# EAGLE design cyboard (EAGLE 9.6.2)
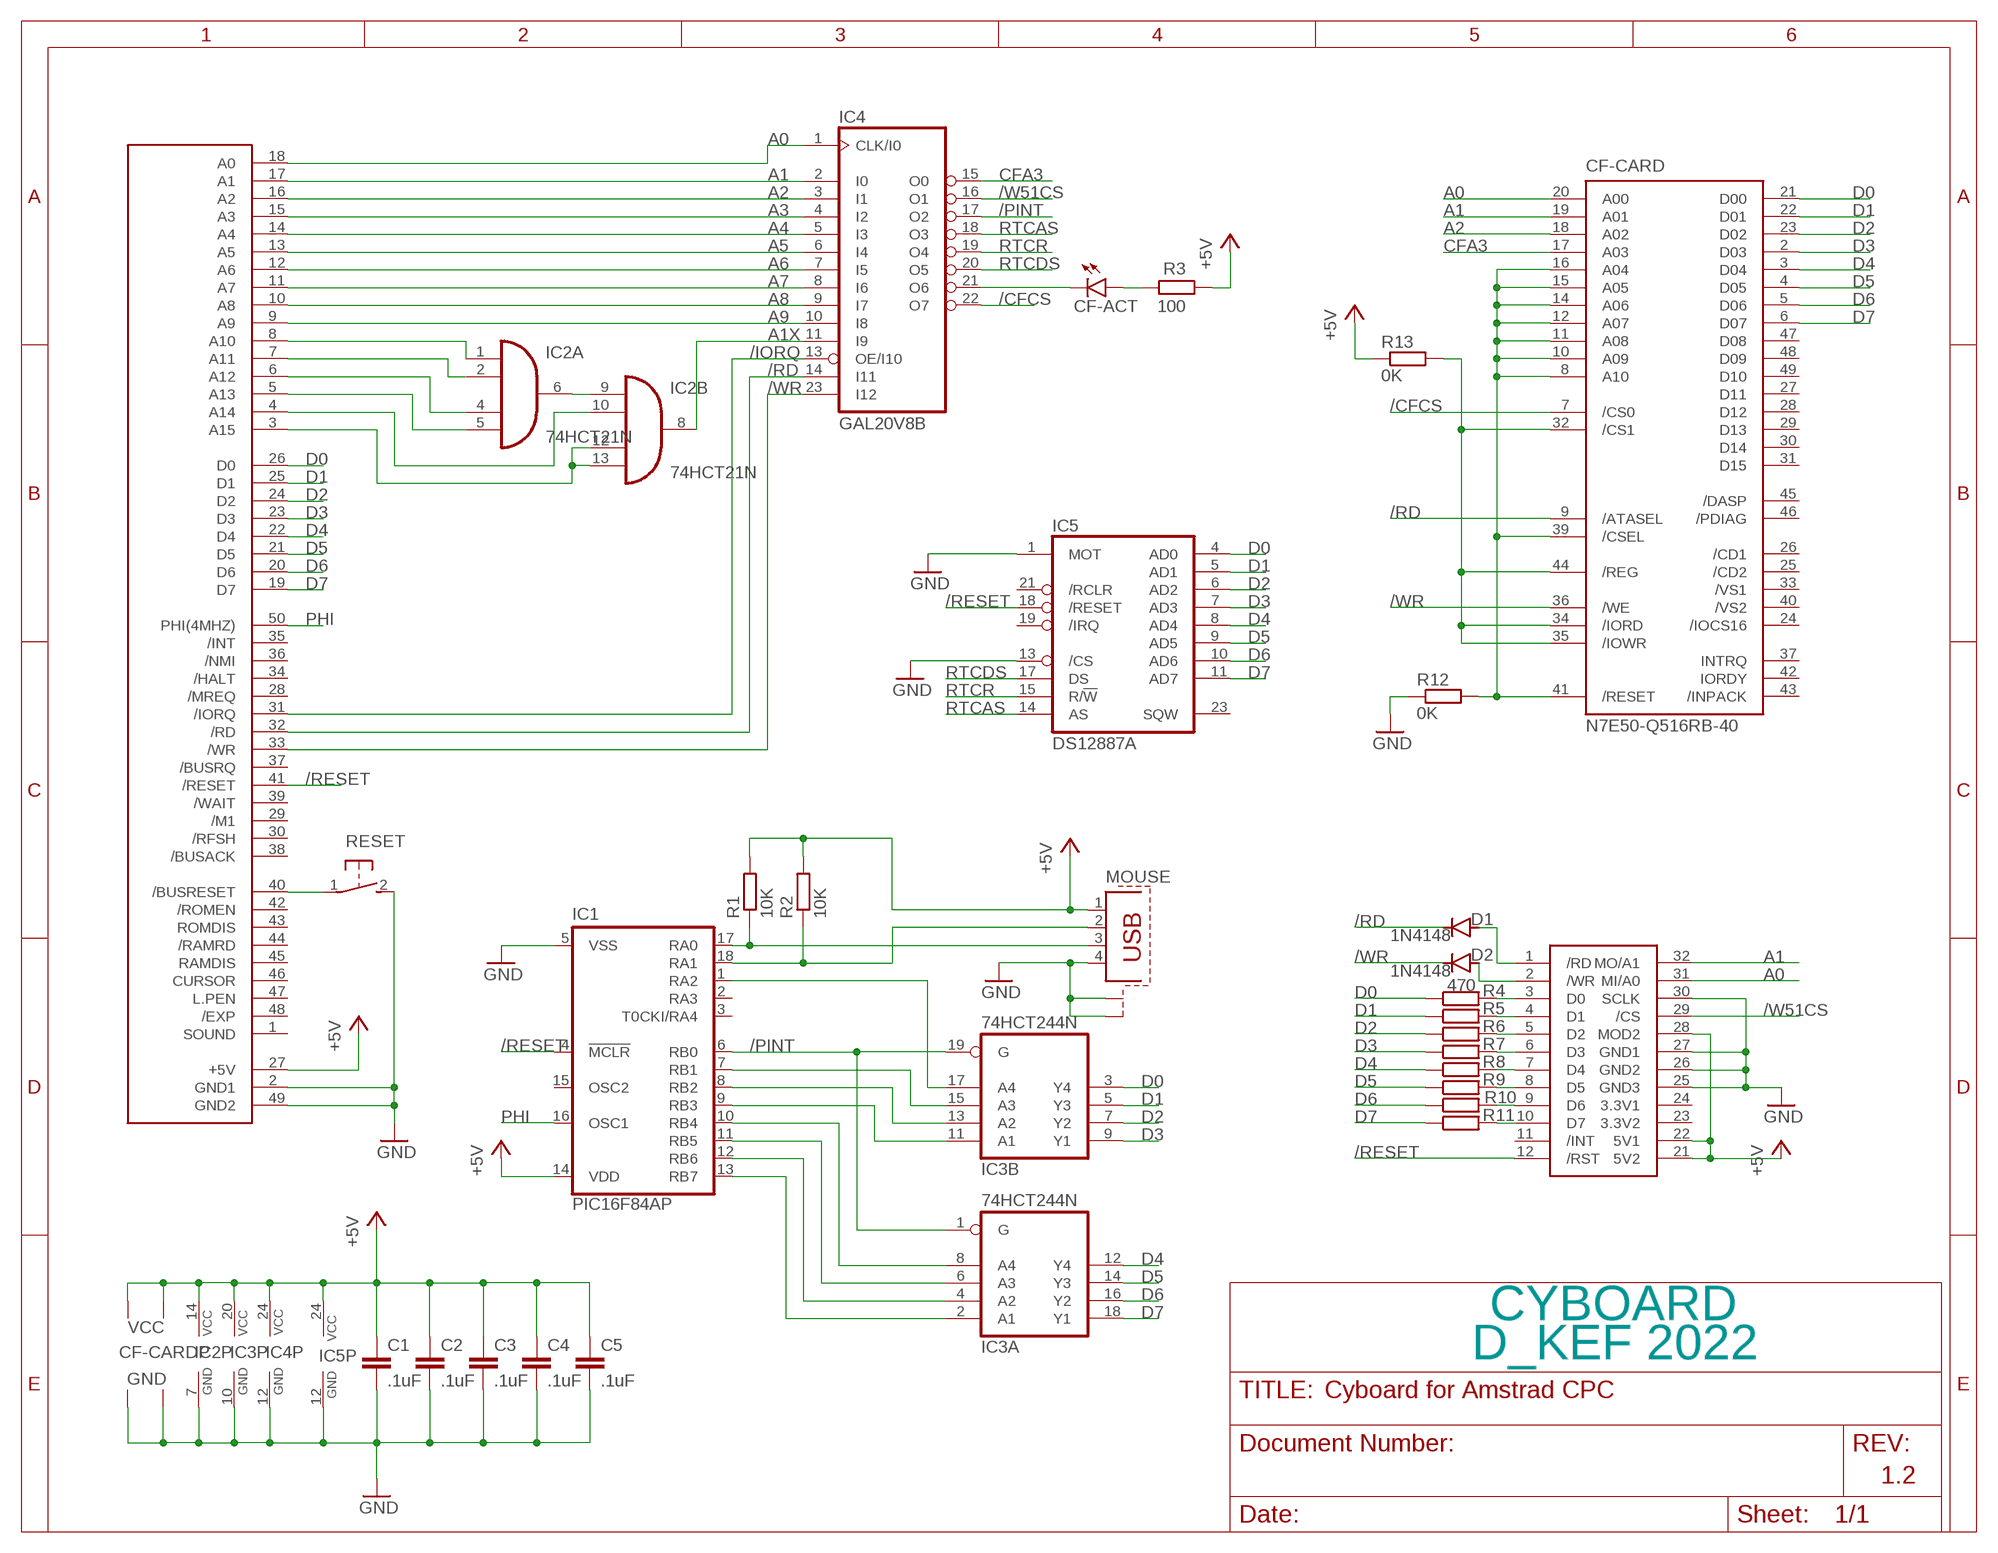
[diagram p0: schematic, sheet 1]
FRAME1 (FRAME_A_L): BANNER1: CYBOARD; BANNER2: D_KEF 2022; REVISION: 1.2; TITLE: Cyboard for Amstrad CPC

## Parts
C1  .1uF  C-EU025-025X050  [C025-025X050]
C2  .1uF  C-EU025-025X050  [C025-025X050]
C3  .1uF  C-EU025-025X050  [C025-025X050]
C4  .1uF  C-EU025-025X050  [C025-025X050]
C5  .1uF  C-EU025-025X050  [C025-025X050]
CF-ACT  CF ACT  LED3MM  [LED3MM]
CF-CARD  N7E50-Q516RB-40  CF-CARD-HEADERHYBRID-1  [3M-N7E50]
CON1  CPCBUS  AMSTRAD_CPC_BUSP  [2X25]
D1  1N4148  1N4148DO35-7  [DO35-7]
D2  1N4148  1N4148DO35-7  [DO35-7]
IC1  PIC16F84AP  [DIL18]
IC2  74HCT21N  74HC21N  [DIL14]
IC3  74HCT244N  [DIL20]
IC4  GAL20V8B  20V8  [DIL24-3]
IC5  DS12887A  DS12887  [DIL24]
MOUSE  PN87520-S  [PN87520-S]
R1  10K  R-EU_0204/7  [0204/7]
R2  10K  R-EU_0204/7  [0204/7]
R3  100  R-EU_0204/7  [0204/7]
R4  470  R-EU_0204/7  [0204/7]
R5  470  R-EU_0204/7  [0204/7]
R6  470  R-EU_0204/7  [0204/7]
R7  470  R-EU_0204/7  [0204/7]
R8  470  R-EU_0204/7  [0204/7]
R9  470  R-EU_0204/7  [0204/7]
R10  470  R-EU_0204/7  [0204/7]
R11  470  R-EU_0204/7  [0204/7]
R12  0K  R-EU_0204/7  [0204/7]
R13  0K  R-EU_0204/7  [0204/7]
RESET  Reset  31-XX  [B3F-31XX]
W5100S-MODULE  W5100S-NETWORK-MODULE  [W5100S-NETWORK-MODULE]

## Nets
/BUSRESET: CON1.40(/BUSRESET) RESET.1(P)
/CFACT: CF-ACT.K(C) IC4.21(O6)
/CFCS: CF-CARD.7(/CS0) IC4.22(O7)
/IORQ: CON1.31(/IORQ) IC4.13(OE/I10)
/PINT: IC1.6(RB0) IC3.1(A:G) IC3.19(B:G) IC4.17(O2)
/RD: CF-CARD.9(/ATASEL) CON1.32(/RD) D1.C IC4.14(I11)
/RESET: CON1.41(/RESET) IC1.4(!MCLR) IC5.18(/RESET) W5100S-MODULE.12(/RST)
/W51CS: IC4.16(O1) W5100S-MODULE.29(/CS)
/W51RD: D1.A W5100S-MODULE.1(/RD)
/W51WR: D2.A W5100S-MODULE.2(/WR)
/WR: CF-CARD.36(/WE) CON1.33(/WR) D2.C IC4.23(I12)
A0: CF-CARD.20(A00) CON1.18(A0) IC4.1(CLK/I0) W5100S-MODULE.31(MI/A0)
A1: CF-CARD.19(A01) CON1.17(A1) IC4.2(I0) W5100S-MODULE.32(MO/A1)
A1X: IC2.8(B:O) IC4.11(I9)
A2: CF-CARD.18(A02) CON1.16(A2) IC4.3(I1)
A3: CON1.15(A3) IC4.4(I2)
A4: CON1.14(A4) IC4.5(I3)
A5: CON1.13(A5) IC4.6(I4)
A6: CON1.12(A6) IC4.7(I5)
A7: CON1.11(A7) IC4.8(I6)
A8: CON1.10(A8) IC4.9(I7)
A9: CON1.9(A9) IC4.10(I8)
A10: CON1.8(A10) IC2.1(A:I0)
A11: CON1.7(A11) IC2.2(A:I1)
A12: CON1.6(A12) IC2.4(A:I2)
A13: CON1.5(A13) IC2.5(A:I3)
A14: CON1.4(A14) IC2.10(B:I1)
A15: CON1.3(A15) IC2.12(B:I2) IC2.13(B:I3)
CFA3: CF-CARD.17(A03) IC4.15(O0)
CFDN [power]: CF-CARD.8(A10) CF-CARD.10(A09) CF-CARD.11(A08) CF-CARD.12(A07) CF-CARD.14(A06) CF-CARD.15(A05) CF-CARD.16(A04) CF-CARD.39(/CSEL) CF-CARD.41(/RESET) R12.2
CFUP: CF-CARD.32(/CS1) CF-CARD.34(/IORD) CF-CARD.35(/IOWR) CF-CARD.44(/REG) R13.2
D0: CF-CARD.21(D00) CON1.26(D0) IC3.3(B:Y4) IC5.4(AD0) R4.1
D1: CF-CARD.22(D01) CON1.25(D1) IC3.5(B:Y3) IC5.5(AD1) R5.1
D2: CF-CARD.23(D02) CON1.24(D2) IC3.7(B:Y2) IC5.6(AD2) R6.1
D3: CF-CARD.2(D03) CON1.23(D3) IC3.9(B:Y1) IC5.7(AD3) R7.1
D4: CF-CARD.3(D04) CON1.22(D4) IC3.12(A:Y4) IC5.8(AD4) R8.1
D5: CF-CARD.4(D05) CON1.21(D5) IC3.14(A:Y3) IC5.9(AD5) R9.1
D6: CF-CARD.5(D06) CON1.20(D6) IC3.16(A:Y2) IC5.10(AD6) R10.1
D7: CF-CARD.6(D07) CON1.19(D7) IC3.18(A:Y1) IC5.11(AD7) R11.1
GND [power]: C1.2 C2.2 C3.2 C4.2 C5.2 CF-CARD.1(GND1) CF-CARD.50(GND2) CON1.2(GND1) CON1.49(GND2) IC1.5(VSS) IC2.7(P:GND) IC3.10(P:GND) IC4.12(GND) IC5.1(MOT) IC5.12(GND) IC5.13(/CS) MOUSE.4 MOUSE.S1 MOUSE.S2 R12.1 RESET.2(S) W5100S-MODULE.25(GND3) W5100S-MODULE.26(GND2) W5100S-MODULE.27(GND1) W5100S-MODULE.30(SCLK)
MOUSED0: IC1.1(RA2) IC3.17(B:A4)
MOUSED1: IC1.7(RB1) IC3.15(B:A3)
MOUSED2: IC1.8(RB2) IC3.13(B:A2)
MOUSED3: IC1.9(RB3) IC3.11(B:A1)
MOUSED4: IC1.10(RB4) IC3.8(A:A4)
MOUSED5: IC1.11(RB5) IC3.6(A:A3)
MOUSED6: IC1.12(RB6) IC3.4(A:A2)
MOUSED7: IC1.13(RB7) IC3.2(A:A1)
N$1: CF-ACT.A R3.2
N$41: IC2.6(A:O) IC2.9(B:I0)
PHI: CON1.50(PHI(4MHZ)) IC1.16(OSC1)
RTCAS: IC4.18(O3) IC5.14(AS)
RTCDS: IC4.20(O5) IC5.17(DS)
RTCR: IC4.19(O4) IC5.15(R/!W)
USBD+: IC1.17(RA0) MOUSE.3 R1.1
USBD-: IC1.18(RA1) MOUSE.2 R2.1
VCC [power]: C1.1 C2.1 C3.1 C4.1 C5.1 CF-CARD.13(VCC2) CF-CARD.38(VCC1) CON1.27(+5V) IC1.14(VDD) IC2.14(P:VCC) IC3.20(P:VCC) IC4.24(VCC) IC5.24(VCC) MOUSE.1 R1.2 R2.2 R3.1 R13.1 W5100S-MODULE.21(5V2) W5100S-MODULE.22(5V1) W5100S-MODULE.28(MOD2) ; supply symbol labelled +5V
W51D0: R4.2 W5100S-MODULE.3(D0)
W51D1: R5.2 W5100S-MODULE.4(D1)
W51D2: R6.2 W5100S-MODULE.5(D2)
W51D3: R7.2 W5100S-MODULE.6(D3)
W51D4: R8.2 W5100S-MODULE.7(D4)
W51D5: R9.2 W5100S-MODULE.8(D5)
W51D6: R10.2 W5100S-MODULE.9(D6)
W51D7: R11.2 W5100S-MODULE.10(D7)
Unconnected: CF-CARD.24(/IOCS16) CF-CARD.25(/CD2) CF-CARD.26(/CD1) CF-CARD.27(D11) CF-CARD.28(D12) CF-CARD.29(D13) CF-CARD.30(D14) CF-CARD.31(D15) CF-CARD.33(/VS1) CF-CARD.37(INTRQ) CF-CARD.40(/VS2) CF-CARD.42(IORDY) CF-CARD.43(/INPACK) CF-CARD.45(/DASP) CF-CARD.46(/PDIAG) CF-CARD.47(D08) CF-CARD.48(D09) CF-CARD.49(D10) CON1.1(SOUND) CON1.28(/MREQ) CON1.29(/M1) CON1.30(/RFSH) CON1.34(/HALT) CON1.35(/INT) CON1.36(/NMI) CON1.37(/BUSRQ) CON1.38(/BUSACK) CON1.39(/WAIT) CON1.42(/ROMEN) CON1.43(ROMDIS) CON1.44(/RAMRD) CON1.45(RAMDIS) CON1.46(CURSOR) CON1.47(L.PEN) CON1.48(/EXP) IC1.2(RA3) IC1.3(T0CKI/RA4) IC1.15(OSC2) IC5.19(/IRQ) IC5.21(/RCLR) IC5.23(SQW) W5100S-MODULE.11(/INT)

## Power pins joined to a net without a drawn wire
3.3V1: W5100S-MODULE.24(3.3V1)
3.3V2: W5100S-MODULE.23(3.3V2)

## Library data of the parts
C1-C5 = rcl:C-EU: CAPACITOR, European symbol; SPICEPREFIX: C
CF-ACT = led:LED: LED OSRAM: - CHIPLED LG R971, LG N971, LY N971, LG Q971, LY Q971, LO R971, LY R971 LH N974, LH R974 LS Q976, LO Q976, LY Q976 LO Q996 - Hyper CHIPLED LW Q18S LB Q993, LB Q99A, LB R99A - SideLED LS A670, LO A670, LY A670, LG A670, LP A670 LB A673, LV A673, LT A673, LW A673 LH A674 LY A675 LS A676, LA A676, LO A676, LY A676, LW A676 LS A679, LY A679, LG A679 - Hyper Micro SIDELED® LS Y876, LA Y876, LO Y876, LY Y876 LT Y87S - SmartLED LW L88C, LW L88S LB L89C, LB L89S, LG L890 LS L89K, LO L89K, LY L89K LS L896, LA L896, LO L896, LY L896 - TOPLED LS T670, LO T670, LY T670, LG T670, LP T670 LSG T670, LSP T670, LSY T670, LOP T670, LYG T670 LG T671, LOG T671, LSG T671 LB T673, LV T673, LT T673, LW T673 LH T674 LS T676, LA T676, LO T676, LY T676, LB T676, LH T676, LSB T676, LW T676 LB T67C, LV T67C, LT T67C, LS T67K, LO T67K, LY T67K, LW E67C LS E67B, LA E67B, LO E67B, LY E67B, LB E67C, LV E67C, LT E67C LW T67C LS T679, LY T679, LG T679 LS T770, LO T770, LY T770, LG T770, LP T770 LB T773, LV T773, LT T773, LW T773 LH T774 LS E675, LA E675, LY E675, LS T675 LS T776, LA T776, LO T776, LY T776, LB T776 LHGB T686 LT T68C, LB T68C - Hyper Mini TOPLED® LB M676 - Mini TOPLED Santana® LG M470 LS M47K, LO M47K, LY M47K Source: http://www.osram.convergy.de LUXEON: - LUMILED® LXK2-PW12-R00, LXK2-PW12-S00, LXK2-PW14-U00, LXK2-PW14-V00 LXK2-PM12-R00, LXK2-PM12-S00, LXK2-PM14-U00 LXK2-PE12-Q00, LXK2-PE12-R00, LXK2-PE12-S00, LXK2-PE14-T00, LXK2-PE14-U00 LXK2-PB12-K00, LXK2-PB12-L00, LXK2-PB12-M00, LXK2-PB14-N00, LXK2-PB14-P00, LXK2-PB14-Q00 LXK2-PR12-L00, LXK2-PR12-M00, LXK2-PR14-Q00, LXK2-PR14-R00 LXK2-PD12-Q00, LXK2-PD12-R00, LXK2-PD12-S00 LXK2-PH12-R00, LXK2-PH12-S00 LXK2-PL12-P00, LXK2-PL12-Q00, LXK2-PL12-R00 Source: www.luxeon.com KINGBRIGHT: KA-3528ASYC Source: www.kingbright.com
CF-CARD = con-compact-flash-cards:CF-CARD-HEADER: Compact Flash Card Header
CON1 = CPC:AMSTRAD_CPC_BUS: AMSTRAD CPC BUS CONNECTOR
D1 D2 = diode:1N4148: DIODE high speed (Philips)
IC1 = microchip:PIC16F8*: MICROCONTROLLER 8-Bit PIC16F8X Family - CMOS Flash/EEPROM Pin Compatible : PIC16F83, PIC16CR83, PIC16F84A, PIC16CR84 see also PIC16C* <DEVICE:PIC16C*>; MF: MICROCHIP; MPN: PIC16F84A-04I/P; OC_FARNELL: 9760865; OC_NEWARK: 69K7635
IC2 = 74xx-eu:74*21: Dual 4-input AND gate
IC3 = 74xx-eu:74*244: Octal BUFFER and LINE DRIVER, 3-state
IC4 = pal:20V8: PAL; MF: FARNELL; MPN: GAL20V8B-25QP; OC_FARNELL: 3327462; OC_NEWARK: 70C8546
IC5 = rtc:DS12887
MOUSE = con-berg:PN87520-S; OC_FARNELL: unknown; OC_NEWARK: unknown
R1-R13 = rcl:R-EU_: RESISTOR, European symbol; SPICEPREFIX: R
RESET = switch-omron:31-XX: OMRON SWITCH; MPN: B3F-3100; OC_FARNELL: 959704; OC_NEWARK: 36M3582
W5100S-MODULE = W5100S Network Module:W5100S-NETWORK-MODULE: W5100S Module TCP/IP Ethernet Module SPI / Parallel Control Interface

## Net classes
0 default: width 0.203 mm, drill 0.102 mm, clearance 0.102 mm
1 power: width 0.356 mm, drill 0.102 mm, clearance 0.102 mm

## Board
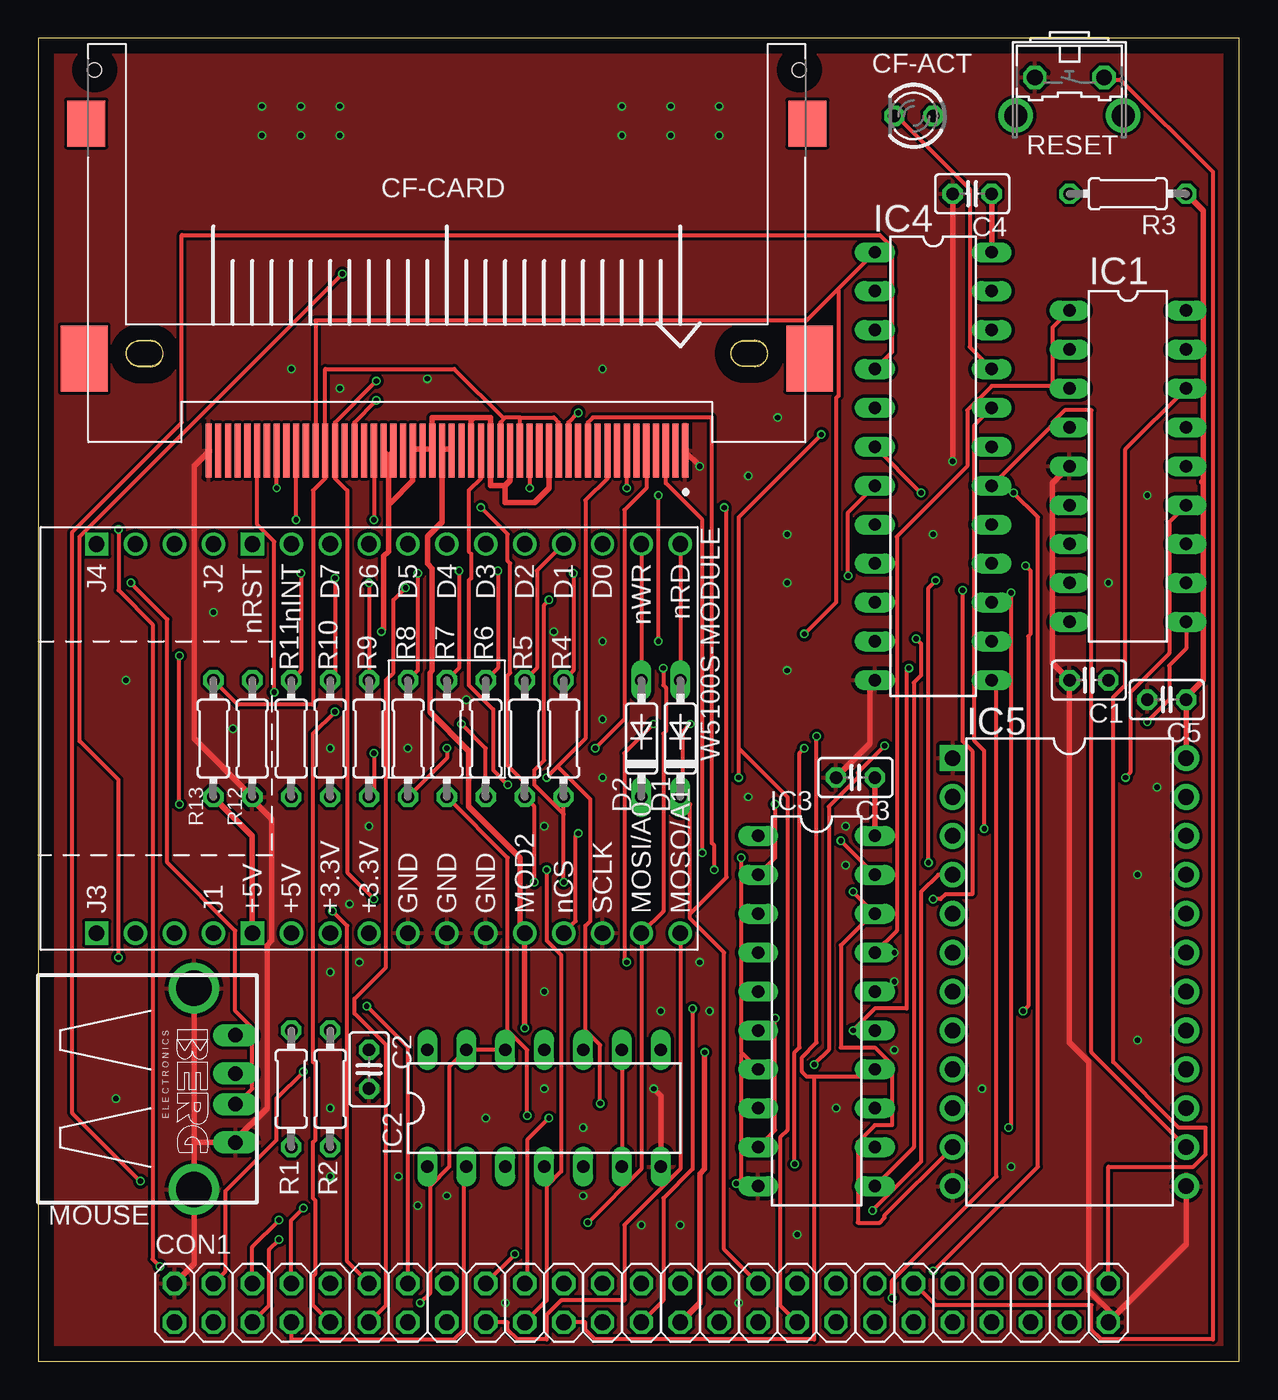
[diagram p1: board, top side]
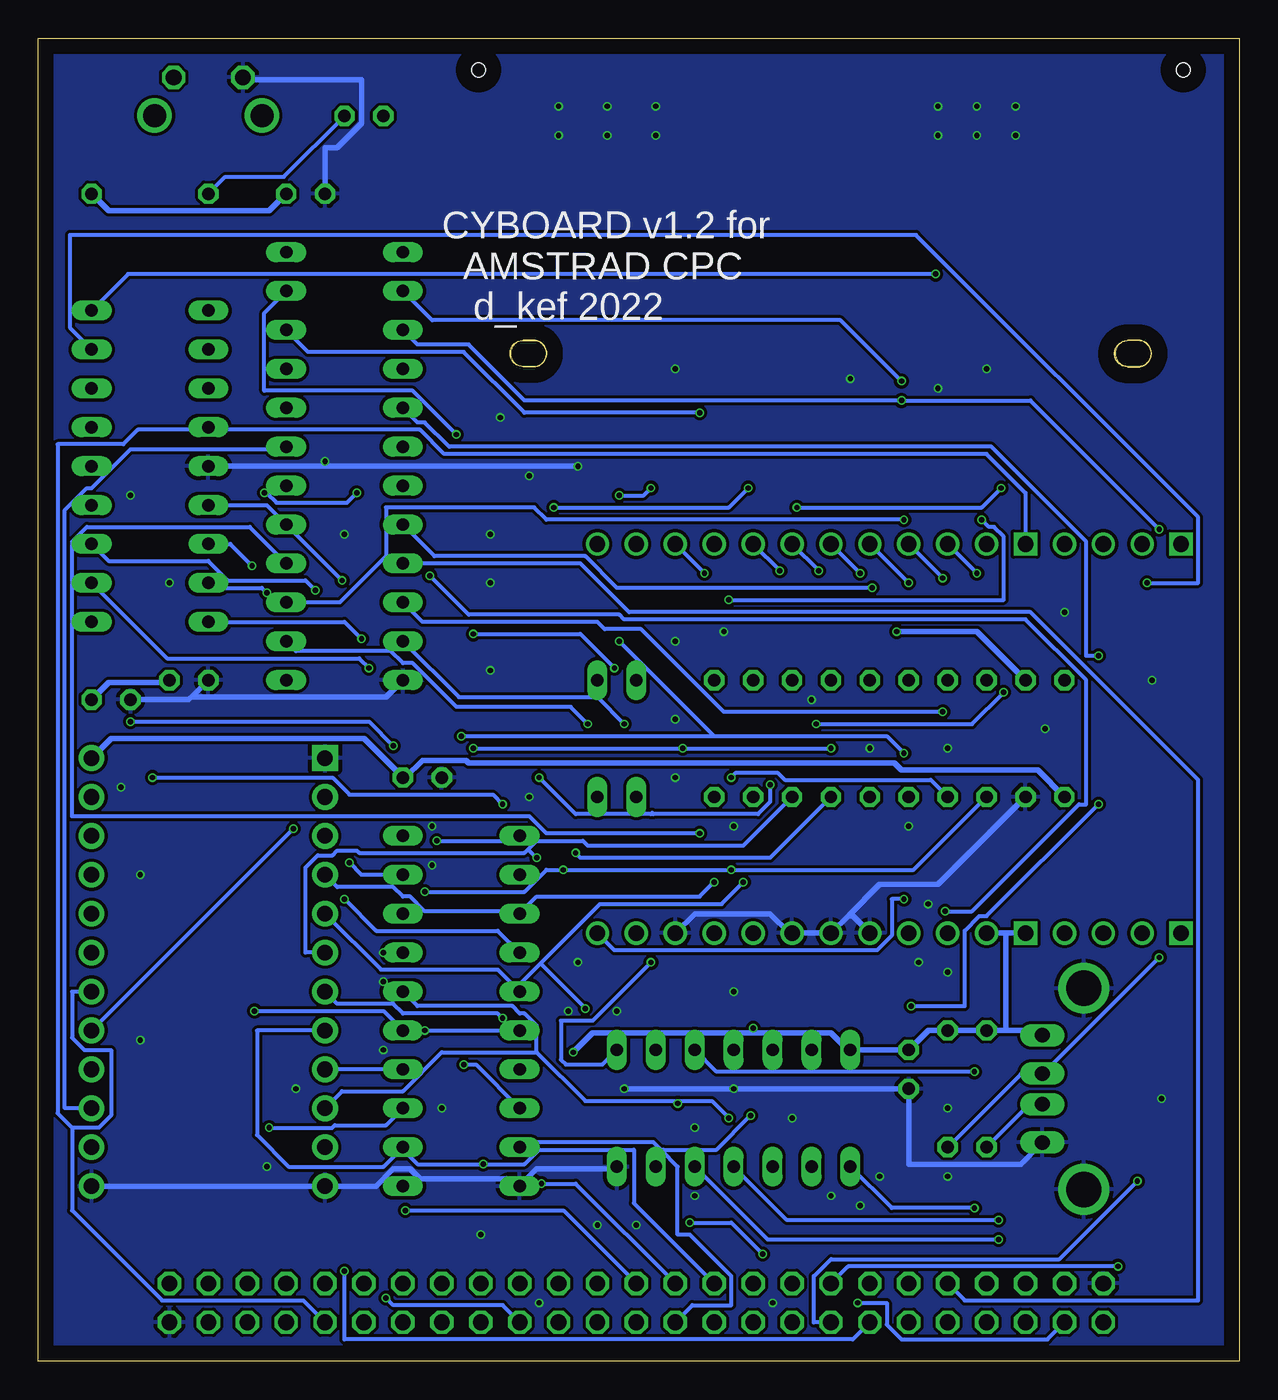
[diagram p2: board, bottom side, seen from below]

Size 78.41 x 86.35 mm. Coordinates in mm from the lower left corner, seen from the top.
Outline: 0,0 78.41,0 78.41,86.35 0,86.35 0,0
Copper layers (1*16): Top 0.035mm / dielectric 1.5mm / Bottom 0.035mm
Design rules "default *": minimum track width 10mil, minimum drill 13mil, track to track 8mil, track to pad 8mil, pad to pad 8mil, via to via 8mil, smd to smd 8mil, copper to edge 40mil, drill to drill 8mil, minimum pad ring 10mil, minimum via ring 4mil, stop-mask expansion 4mil, vias tented up to drill 25mil, thermal gap 10mil

### Footprints (pad centres in the part's own frame; a part is rotated, then mirrored left to right if it is on the bottom)
C025-025X050 = drill 0.813 octagon: 1 -1.27,0; 2 1.27,0
LED3MM = drill 0.813 octagon: A -1.27,0; K 1.27,0
3M-N7E50 = smd 0.4 x 3.5: 1 15.557,-6.604; 2 14.287,-6.604; 3 13.018,-6.604; 4 11.748,-6.604; 5 10.477,-6.604; 6 9.207,-6.604; 7 7.938,-6.604; 8 6.668,-6.604; 9 5.397,-6.604; 10 4.128,-6.604; 11 2.857,-6.604; 12 1.587,-6.604; 13 0.318,-6.604; 14 -0.953,-6.604; 15 -2.223,-6.604; 16 -3.493,-6.604; 17 -4.763,-6.604; 18 -6.032,-6.604; 19 -7.303,-6.604; 20 -8.572,-6.604; 21 -9.842,-6.604; 22 -11.113,-6.604; 23 -12.383,-6.604; 24 -13.652,-6.604; 25 -14.922,-6.604; 26 14.922,-6.604; 27 13.652,-6.604; 28 12.383,-6.604; 29 11.113,-6.604; 30 9.842,-6.604; 31 8.572,-6.604; 32 7.303,-6.604; 33 6.032,-6.604; 34 4.763,-6.604; 35 3.493,-6.604; 36 2.223,-6.604; 37 0.953,-6.604; 38 -0.318,-6.604; 39 -1.587,-6.604; 40 -2.857,-6.604; 41 -4.128,-6.604; 42 -5.397,-6.604; 43 -6.668,-6.604; 44 -7.938,-6.604; 45 -9.207,-6.604; 46 -10.477,-6.604; 47 -11.748,-6.604; 48 -13.018,-6.604; 49 -14.287,-6.604; 50 -15.557,-6.604 | smd 2.5 x 3: S1 23.54,14.746; S2 -23.54,14.746 | smd 3.048 x 4.318: S3 23.683,-0.591; S4 -23.678,-0.604 | hole 0.9: 23,18.246; -23,18.246
2X25 = drill 1.016 octagon: 1 -30.48,-1.27; 2 -30.48,1.27; 3 -27.94,-1.27; 4 -27.94,1.27; 5 -25.4,-1.27; 6 -25.4,1.27; 7 -22.86,-1.27; 8 -22.86,1.27; 9 -20.32,-1.27; 10 -20.32,1.27; 11 -17.78,-1.27; 12 -17.78,1.27; 13 -15.24,-1.27; 14 -15.24,1.27; 15 -12.7,-1.27; 16 -12.7,1.27; 17 -10.16,-1.27; 18 -10.16,1.27; 19 -7.62,-1.27; 20 -7.62,1.27; 21 -5.08,-1.27; 22 -5.08,1.27; 23 -2.54,-1.27; 24 -2.54,1.27; 25 0,-1.27; 26 0,1.27; 27 2.54,-1.27; 28 2.54,1.27; 29 5.08,-1.27; 30 5.08,1.27; 31 7.62,-1.27; 32 7.62,1.27; 33 10.16,-1.27; 34 10.16,1.27; 35 12.7,-1.27; 36 12.7,1.27; 37 15.24,-1.27; 38 15.24,1.27; 39 17.78,-1.27; 40 17.78,1.27; 41 20.32,-1.27; 42 20.32,1.27; 43 22.86,-1.27; 44 22.86,1.27; 45 25.4,-1.27; 46 25.4,1.27; 47 27.94,-1.27; 48 27.94,1.27; 49 30.48,-1.27; 50 30.48,1.27
DO35-7 = drill 0.813 long: A 3.81,0; C -3.81,0
DIL18 = drill 0.813 long: 1 -10.16,-3.81; 2 -7.62,-3.81; 3 -5.08,-3.81; 4 -2.54,-3.81; 5 0,-3.81; 6 2.54,-3.81; 7 5.08,-3.81; 8 7.62,-3.81; 9 10.16,-3.81; 10 10.16,3.81; 11 7.62,3.81; 12 5.08,3.81; 13 2.54,3.81; 14 0,3.81; 15 -2.54,3.81; 16 -5.08,3.81; 17 -7.62,3.81; 18 -10.16,3.81
DIL14 = drill 0.813 long: 1 -7.62,-3.81; 2 -5.08,-3.81; 3 -2.54,-3.81; 4 0,-3.81; 5 2.54,-3.81; 6 5.08,-3.81; 7 7.62,-3.81; 8 7.62,3.81; 9 5.08,3.81; 10 2.54,3.81; 11 0,3.81; 12 -2.54,3.81; 13 -5.08,3.81; 14 -7.62,3.81
DIL20 = drill 0.813 long: 1 -11.43,-3.81; 2 -8.89,-3.81; 3 -6.35,-3.81; 4 -3.81,-3.81; 5 -1.27,-3.81; 6 1.27,-3.81; 7 3.81,-3.81; 8 6.35,-3.81; 9 8.89,-3.81; 10 11.43,-3.81; 11 11.43,3.81; 12 8.89,3.81; 13 6.35,3.81; 14 3.81,3.81; 15 1.27,3.81; 16 -1.27,3.81; 17 -3.81,3.81; 18 -6.35,3.81; 19 -8.89,3.81; 20 -11.43,3.81
DIL24-3 = drill 0.813 long: 1 -13.97,-3.81; 2 -11.43,-3.81; 3 -8.89,-3.81; 4 -6.35,-3.81; 5 -3.81,-3.81; 6 -1.27,-3.81; 7 1.27,-3.81; 8 3.81,-3.81; 9 6.35,-3.81; 10 8.89,-3.81; 11 11.43,-3.81; 12 13.97,-3.81; 13 13.97,3.81; 14 11.43,3.81; 15 8.89,3.81; 16 6.35,3.81; 17 3.81,3.81; 18 1.27,3.81; 19 -1.27,3.81; 20 -3.81,3.81; 21 -6.35,3.81; 22 -8.89,3.81; 23 -11.43,3.81; 24 -13.97,3.81
DIL24 = drill 1.016 pad 1.676 square: 1 -13.97,-7.62 | drill 1.016 pad 1.676: 2 -11.43,-7.62; 3 -8.89,-7.62; 4 -6.35,-7.62; 5 -3.81,-7.62; 6 -1.27,-7.62; 7 1.27,-7.62; 8 3.81,-7.62; 9 6.35,-7.62; 10 8.89,-7.62; 11 11.43,-7.62; 12 13.97,-7.62; 13 13.97,7.62; 14 11.43,7.62; 15 8.89,7.62; 16 6.35,7.62; 17 3.81,7.62; 18 1.27,7.62; 19 -1.27,7.62; 20 -3.81,7.62; 21 -6.35,7.62; 22 -8.89,7.62; 23 -11.43,7.62; 24 -13.97,7.62
PN87520-S = drill 0.95 long: 1 -3.5,2.71; 2 -1,2.71; 3 1,2.71; 4 3.5,2.71 | drill 2.3 pad 2.9: S1 -6.57,0; S2 6.57,0
0204/7 = drill 0.813 octagon: 1 -3.81,0; 2 3.81,0
B3F-31XX = drill 1.016 octagon: 1 -2.261,-1.245; 2 2.261,-1.245 | drill 1.499 pad 2.159: 3 -3.505,1.245; 4 3.505,1.245
W5100S-NETWORK-MODULE = drill 1.016: 1 -12.7,19.05; 2 -12.7,16.51; 3 -12.7,13.97; 4 -12.7,11.43; 5 -12.7,8.89; 6 -12.7,6.35; 7 -12.7,3.81; 8 -12.7,1.27; 9 -12.7,-1.27; 10 -12.7,-3.81; 11 -12.7,-6.35; 13 -12.7,-11.43; 14 -12.7,-13.97; 15 -12.7,-16.51; 18 12.7,-16.51; 19 12.7,-13.97; 20 12.7,-11.43; 22 12.7,-6.35; 23 12.7,-3.81; 24 12.7,-1.27; 25 12.7,1.27; 26 12.7,3.81; 27 12.7,6.35; 28 12.7,8.89; 29 12.7,11.43; 30 12.7,13.97; 31 12.7,16.51; 32 12.7,19.05 | drill 1.016 square: 12 -12.7,-8.89; 16 -12.7,-19.05; 17 12.7,-19.05; 21 12.7,-8.89

### Placement (x,y rotation side)
C1  68.58,44.45 180 top
C2  21.59,19.05 270 top
C3  53.34,38.1 180 top
C4  60.96,76.2 180 top
C5  73.66,43.18 180 top
CF-ACT  57.15,81.28 180 top
CF-CARD  26.67,66.04 0 top
CON1  39.37,3.81 0 top
D1  41.91,40.64 90 top
D2  39.37,40.64 90 top
IC1  71.12,58.42 270 top
IC2  33.02,16.51 0 top
IC3  50.8,22.86 270 top
IC4  58.42,58.42 270 top
IC5  67.31,25.4 270 top
MOUSE  10.16,17.78 270 top
R1  16.51,17.78 90 top
R2  19.05,17.78 90 top
R3  71.12,76.2 180 top
R4  34.29,40.64 90 top
R5  31.75,40.64 90 top
R6  29.21,40.64 90 top
R7  26.67,40.64 90 top
R8  24.13,40.64 90 top
R9  21.59,40.64 90 top
R10  19.05,40.64 90 top
R11  16.51,40.64 90 top
R12  13.97,40.64 90 top
R13  11.43,40.64 90 top
RESET  67.31,82.55 180 top
W5100S-MODULE  22.86,40.64 270 top

### Tracks (layer width: path | path; a pad name or v marks a point on that pad's centre or on a via)
/BUSRESET
  Top 0.254: CON1.40 58.58,3.65 68.74,3.65 68.74,2.06 69.37,1.43 76.68,1.43 76.68,77.63 70.64,83.66 69.69,83.66 RESET.1
/CFACT
  Top 0.254: IC4.21 60.8,66.2 60.8,76.52 56.04,81.28 CF-ACT.K
/CFCS  (via drill 0.35)
  Top 0.254: v35.24,61.91 34.61,61.28 CF-CARD.7
  Bottom 0.254: v35.24,61.91 46.67,61.91 50.64,65.88 60.8,65.88 IC4.22
/IORQ  (via drill 0.35)
  Top 0.254: IC4.13 62.55,44.13 62.55,12.07 55.72,5.24 v55.72,4.13
  Bottom 0.254: v55.72,4.13 55.24,3.65 48.1,3.65 CON1.31
/PINT  (via drill 0.35)
  Top 0.254: IC3.19 v52.39,33.97 | v58.58,50.96 58.1,50.48 v58.1,32.54
  Bottom 0.254: IC1.6 63.5,55.88 IC4.17 v58.58,50.96 | IC3.1 47.31,33.97 v52.39,33.97 | v58.1,32.54 57.31,31.75 IC3.19
/RD  (via drill 0.35)
  Top 0.254: 42.55,29.21 42.55,28.89 44.77,26.67 44.77,7.3 CON1.32 | 42.55,29.21 42.55,36.35 42.07,36.83 | v42.55,41.59 42.07,41.12 42.07,36.83 | v44.77,55.72 44.93,55.56 44.93,31.59 42.55,29.21 | 42.07,36.83 D1.C | CF-CARD.9 v32.07,56.99
  Bottom 0.254: IC4.14 61.59,46.35 55.4,46.35 54.61,45.56 53.97,45.56 51.12,42.7 43.66,42.7 v42.55,41.59 | v32.07,56.99 33.34,55.72 v44.77,55.72
/RESET
  Bottom 0.254: CON1.41 61.12,3.97 70.33,3.97 76.2,9.84 76.2,15.24 | 76.2,15.24 74.45,15.24 73.66,16.03 73.66,20.32 75.41,20.32 76.2,21.11 76.2,24.13 IC5.18 | 76.2,15.24 77.15,16.19 77.15,59.85 72.87,59.85 71.91,60.8 67.31,60.8 IC1.4 67.15,60.8 53.5,60.8 51.91,59.21 16.51,59.21 13.97,56.67 W5100S-MODULE.12
/W51CS  (via drill 0.35)
  Top 0.254: v35.24,34.45 35.08,34.29 35.08,28.73 W5100S-MODULE.29
  Bottom 0.254: v35.24,34.45 45.24,34.45 46.36,35.56 76.2,35.56 76.2,53.5 75.25,54.45 64.61,54.45 IC4.16
/W51RD
  Top 0.254: W5100S-MODULE.1 D1.A
/W51WR
  Top 0.254: W5100S-MODULE.2 D2.A
/WR  (via drill 0.35)
  Top 0.254: v30.64,37.62 29.69,38.58 29.69,42.54 28.1,44.13 28.1,50.96 28.26,51.12 28.26,52.7 28.1,52.86 28.1,56.83 28.89,57.63 CF-CARD.36 | v51.12,60.48 45.72,55.09 45.72,40 | v45.72,38.1 45.72,40 | CON1.33 48.42,3.65 48.42,14.61 48.89,15.08 48.89,36.83 45.72,40
  Bottom 0.254: v30.64,37.62 30.64,36.51 31.43,35.72 38.26,35.72 38.34,35.8 38.42,35.72 39.37,35.72 | IC4.23 63.66,68.42 63.66,63.34 53.97,63.34 v51.12,60.48 | v45.72,38.1 43.34,35.72 39.37,35.72 | 39.37,35.72 D2.C
A0  (via drill 0.35)
  Top 0.254: v35.88,9.05 39.37,12.54 W5100S-MODULE.31 40.8,29.37 40.8,40.96 40.96,41.12 40.96,43.97 40.8,44.13 v40.8,45.24 | 52.15,69.93 50.17,67.95 18.1,67.95 CF-CARD.20 | v50.01,47.47 52.07,49.53 52.07,62.87 52.23,63.02 52.23,69.85 52.15,69.93 | 52.15,69.93 IC4.1 | CON1.18 v31.11,6.99
  Bottom 0.254: v31.11,6.99 33.18,9.05 v35.88,9.05 | v40.8,45.24 43.02,47.47 v50.01,47.47
A1  (via drill 0.35)
  Top 0.254: W5100S-MODULE.32 41.91,12.54 38.26,8.89 38.26,3.97 34.13,3.97 33.18,3.02 33.18,1.43 31.27,1.43 30.64,2.06 30.64,2.54 CON1.17 | v21.91,30.16 20.16,31.91 20.16,56.83 19.37,57.63 CF-CARD.19 19.37,61.28 v22.07,63.98
  Bottom 0.254: W5100S-MODULE.32 40.8,26.83 23.65,26.83 22.7,27.78 22.7,30.16 v21.91,30.16 | v22.07,63.98 26.04,67.95 52.7,67.95 IC4.2
A1X  (via drill 0.35)
  Top 0.254: v38.42,26.04 38.26,26.19 38.26,39.69 v40.16,41.59
  Bottom 0.254: IC2.8 41.59,19.37 43.97,19.37 44.29,19.68 44.29,22.23 42.23,22.23 v38.42,26.04 | v40.16,41.59 41.91,43.34 50.96,43.34 IC4.11
A2  (via drill 0.35)
  Top 0.254: v22.07,62.71 20.64,61.28 CF-CARD.18 | v7.94,6.19 7.46,6.67 7.46,48.1 5.24,50.32 v5.24,54.29
  Bottom 0.254: v7.94,6.19 25.56,6.19 CON1.16 | v5.24,54.29 13.65,62.71 v22.07,62.71 46.67,62.71 50.32,66.36 53.66,66.36 IC4.3
A3  (via drill 0.35)
  Top 0.254: IC4.4 55.72,65.88 55.72,72.71 54.93,73.5 9.37,73.5 9.37,61.28 2.22,54.13 2.22,16.19 v6.67,11.75
  Bottom 0.254: v6.67,11.75 11.75,6.67 26.67,6.67 27.78,5.56 27.78,2.54 CON1.15
A4  (via drill 0.35)
  Top 0.254: v9.21,36.35 v9.21,46.04 | v21.43,23.18 24.13,20.48 CON1.14
  Bottom 0.254: IC4.5 53.66,61.28 53.18,61.28 51.59,59.69 16.19,59.69 10,53.5 10,46.04 v9.21,46.04 | v9.21,36.35 16.51,29.05 16.99,29.05 17.94,28.1 17.94,23.18 v21.43,23.18
A5  (via drill 0.35)
  Top 0.254: v57.63,56.67 IC4.6 | v63.66,56.67 65.25,55.09 65.25,12.7 v58.42,5.87
  Bottom 0.254: v57.63,56.67 58.26,56.04 62.86,56.04 63.5,56.67 v63.66,56.67 | v58.42,5.87 58.42,1.43 25.24,1.43 CON1.13
A6  (via drill 0.35)
  Top 0.254: IC4.7 52.86,55.4 v52.86,51.28 | v19.21,29.37 20.16,28.42 20.16,6.51 CON1.12
  Bottom 0.254: v52.86,51.28 50.32,48.74 40.48,48.74 40.16,48.42 13.97,48.42 10,44.45 10,36.35 10.48,36.35 17.46,29.37 v19.21,29.37
A7  (via drill 0.35)
  Top 0.254: v23.97,50.48 23.18,49.69 23.18,44.93 22.7,44.45 22.7,25.72 20.64,23.65 20.64,22.7 22.7,20.64 22.7,3.65 CON1.11
  Bottom 0.254: IC4.8 52.55,52.55 42.7,52.55 40.64,50.48 v23.97,50.48
A8
  Bottom 0.254: IC4.9 43.02,52.07 39.85,48.89 13.65,48.89 2.7,37.94 2.7,3.97 17.94,3.97 CON1.10
A9  (via drill 0.35)
  Top 0.254: v19.37,42.39 17.94,40.96 17.94,19.53 18.1,19.37 18.1,14.45 17.94,14.29 17.94,10.64 18.1,10.48 18.1,5.71 17.94,5.56 17.94,3.65 CON1.9
  Bottom 0.254: IC4.10 53.34,48.26 41.91,48.26 41.43,47.78 39.05,47.78 33.66,42.39 v19.37,42.39
A10  (via drill 0.35)
  Top 0.254: v17.3,10 16.51,9.21 CON1.8
  Bottom 0.254: IC2.1 22.7,10 v17.3,10
A11
  Top 0.254: IC2.2 27.78,12.54 27.78,2.06 27.15,1.43 16.51,1.43 CON1.7
A12  (via drill 0.35)
  Top 0.254: v15.72,9.21 13.97,7.46 CON1.6
  Bottom 0.254: IC2.4 29.53,9.21 v15.72,9.21
A13  (via drill 0.35)
  Top 0.254: v15.72,7.94 15.08,7.3 15.08,3.65 CON1.5
  Bottom 0.254: IC2.5 30.8,7.94 v15.72,7.94
A14  (via drill 0.35)
  Top 0.254: v17.3,18.89 15.56,17.14 15.56,14.45 12.22,11.11 12.22,5.87 CON1.4
  Bottom 0.254: IC2.10 34.13,18.89 v17.3,18.89
A15  (via drill 0.35)
  Top 0.254: IC2.12 IC2.13 26.83,19.21 26.83,12.7 25.56,11.43 25.56,4.45 v24.92,3.81
  Bottom 0.254: CON1.3 12.54,1.43 22.07,1.43 23.02,2.38 23.02,3.81 v24.92,3.81
CFA3  (via drill 0.35)
  Top 0.254: CF-CARD.17 v21.91,54.93
  Bottom 0.254: v21.91,54.93 45.24,54.93 46.04,55.72 55.72,55.72 55.72,52.55 58.74,49.53 IC4.15
CFDN  (via drill 0.35)
  Top 0.356: 28.26,61.44 CF-CARD.12 | 28.26,61.44 28.42,61.59 29.53,61.59 CF-CARD.11 29.53,57.15 30.48,57.15 | CF-CARD.10 30.8,57.47 30.48,57.15 | CF-CARD.8 33.34,56.99 32.39,56.04 30.48,56.04 30.48,57.15 | v22.38,47.62 22.54,47.78 22.54,52.55 22.86,52.86 22.86,56.04 | 22.86,59.05 22.86,56.04 | 22.86,59.05 22.54,59.37 CF-CARD.41 | CF-CARD.16 23.18,59.37 23.02,59.21 23.02,59.05 22.86,59.05 | 22.86,56.04 23.02,56.04 24.45,57.47 CF-CARD.15 24.45,59.53 25.08,59.53 CF-CARD.39 25.24,59.53 25.72,59.53 CF-CARD.14 25.72,61.59 28.26,61.59 28.26,61.44
  Bottom 0.356: R12.2 17.14,47.62 v22.38,47.62
CFUP
  Top 0.254: CF-CARD.35 30.16,61.28 30.4,61.52 | 30.4,61.52 30.48,61.59 31.43,61.59 | CF-CARD.34 31.43,61.59 | CF-CARD.32 33.97,61.28 33.66,61.59 31.43,61.59 | R13.2 13.02,42.86 17.94,42.86 17.94,56.83 18.73,57.63 CF-CARD.44 18.73,64.77 27.15,64.77 30.4,61.52
D0  (via drill 0.35)
  Top 0.254: v54.45,9.84 57.63,13.02 57.63,30.64 58.74,31.75 IC5.4 | v34.29,31.27 34.29,35.72 | 34.29,35.72 R4.1 | v16.83,54.93 CF-CARD.21 | v33.34,49.69 33.02,49.37 33.02,39.21 32.39,38.58 32.39,37.62 34.29,35.72
  Bottom 0.254: CON1.26 44.13,9.84 v54.45,9.84 | v34.29,31.27 35.24,30.32 45.88,30.32 IC3.3 46.99,29.37 53.18,29.37 54.13,30.32 54.61,30.32 55.24,30.96 58.9,30.96 IC5.4 | v16.83,54.93 16.35,54.45 16.03,54.45 15.4,53.82 15.4,49.69 v33.34,49.69
D1  (via drill 0.35)
  Top 0.254: v32.39,31.27 32.39,36.2 R5.1 31.75,37.78 30.64,38.89 30.64,44.77 30.8,44.93 30.8,52.07 30.64,52.23 30.64,53.97 v28.89,55.72 | CON1.25 40.8,3.97 40.8,10.64 42.7,12.54 v42.7,23.02 | v15.56,56.99 CF-CARD.22
  Bottom 0.254: IC5.5 56.04,25.56 48.42,25.56 IC3.5 47.15,24.45 45.64,25.96 | v32.39,31.27 33.81,29.84 41.75,29.84 45.64,25.96 | 45.64,25.96 v42.7,23.02 | v15.56,56.99 16.83,55.72 v28.89,55.72
D2  (via drill 0.35)
  Top 0.254: 45.96,20.08 45.88,20.16 v45.88,32.86 | 45.96,20.08 IC3.7 | v45.56,11.59 45.88,11.91 45.88,20 45.96,20.08 | CF-CARD.23 14.29,54.61 15.4,53.5 v15.4,43.66 | v27.62,41.59 29.21,40 R6.1
  Bottom 0.254: R6.1 32.39,33.65 42.55,33.65 42.86,33.97 45.88,33.97 46.43,33.42 | 46.43,33.42 46.67,33.18 57.47,33.18 57.63,33.34 58.9,33.34 59.21,33.02 60.17,33.02 60.96,32.23 60.96,26.67 IC5.6 | 46.43,33.42 v45.88,32.86 | CON1.24 43.34,11.59 v45.56,11.59 | v15.4,43.66 17.46,41.59 v27.62,41.59
D3  (via drill 0.35)
  Top 0.254: R7.1 30.64,32.86 30.64,21.59 31.91,20.32 v31.91,16.03 | v48.1,22.38 48.1,15.08 IC3.9 | CF-CARD.2 40.96,57.31 43.34,54.93 v43.34,33.18
  Bottom 0.254: IC3.9 46.67,14.29 38.26,14.29 37.7,13.73 | 37.7,13.73 36.67,12.7 36.67,8.26 35.88,8.26 33.18,5.56 33.18,3.65 35.72,3.65 CON1.23 | v31.91,16.03 34.13,13.81 37.62,13.81 37.7,13.73 | IC5.7 58.9,23.34 55.24,23.34 54.61,22.7 48.42,22.7 v48.1,22.38 | v43.34,33.18 43.02,32.86 30.64,32.86 R7.1
D4  (via drill 0.35)
  Top 0.254: R8.1 26.67,39.37 v26.67,40 | v36.35,40 38.26,41.91 38.26,55.56 39.69,56.99 CF-CARD.3 | v50.01,40 49.69,39.69 49.69,20.48 49.37,20.16 v49.37,12.86
  Bottom 0.254: v26.67,40 v36.35,40 v50.01,40 | IC5.8 64.13,21.59 64.13,14.76 62.07,12.7 55.88,12.7 IC3.12 54.61,13.81 53.66,12.86 v49.37,12.86 46.67,12.86 45.72,13.81 39.53,13.81 39.53,10.32 CON1.22
D5  (via drill 0.35)
  Top 0.254: R9.1 21.91,37.15 v21.91,39.69 | v50.8,40.8 50.8,20.8 49.85,19.84 49.85,18.89 50.17,18.57 50.64,18.57 | 50.64,18.57 54.61,18.57 IC3.14 | CON1.21 35.72,2.54 35.72,2.06 36.35,1.43 50.64,1.43 50.64,18.57 | v38.42,56.99 CF-CARD.4 | v40.48,46.99 v40.48,56.51
  Bottom 0.254: v21.91,39.69 23.02,40.8 34.29,40.8 | v50.8,40.8 34.29,40.8 | IC3.14 IC5.9 | v38.42,56.99 38.89,56.51 v40.48,56.51 | 34.29,40.8 v40.48,46.99
D6  (via drill 0.35)
  Top 0.254: 33.89,38.81 35.72,40.64 35.72,56.2 37.15,57.63 CF-CARD.5 | 33.89,38.81 v33.18,38.1 | CON1.20 31.91,5.24 31.91,14.45 v33.34,15.88 | 33.89,38.81 36.04,36.67 36.04,28.73 35.72,28.42 35.72,21.59 36.67,20.64 v36.67,16.83
  Bottom 0.254: R10.1 20.16,37.94 29.69,37.94 30.16,38.42 32.86,38.42 v33.18,38.1 | IC3.16 53.66,23.18 47.47,23.18 46.99,22.7 46.67,22.7 45.88,21.91 45.88,20.16 | 45.88,20.16 52.07,20.16 54.61,17.62 58.58,17.62 IC5.10 | v33.34,15.88 34.45,16.99 36.67,16.99 | 36.67,16.99 42.7,16.99 45.88,20.16 | 36.67,16.99 v36.67,16.83
D7  (via drill 0.35)
  Top 0.254: v53.18,30.64 IC3.18 54.45,29.21 52.39,27.15 52.39,20.48 54.61,20.48 55.72,19.37 55.72,15.4 54.61,15.4 53.5,14.29 53.5,9.05 54.93,9.05 55.24,9.37 55.24,9.53 IC5.11 | CON1.19 33.18,3.97 33.18,11.43 34.13,12.38 34.13,26.51 33.18,27.46 v33.18,32.07 | CF-CARD.6 35.88,61.28 36.2,61.59 43.97,61.59 43.97,33.81 44.13,33.65 v44.13,32.07
  Bottom 0.254: R11.1 21.27,32.07 v33.18,32.07 v44.13,32.07 45.24,32.07 46.67,30.64 v53.18,30.64
GND  (via drill 0.35)
  Top 0.356: CON1.2 10.16,6.35 MOUSE.S2 10.16,14.29 | 10.16,14.29 MOUSE.S1 | 10.16,14.29 MOUSE.4 12.86,14.45 14.92,16.51 14.92,27.15 15.24,27.46 15.24,35.4 13.97,36.67 R12.1 10.16,40.64 10.16,58.42 11.11,59.37 CF-CARD.50 | IC5.13 74.93,7.62 CON1.49 70.17,3.02 68.58,4.6 68.58,19.53 67.31,20.8 C1.2 66.2,45.56 66.2,57.31 IC1.5 | C3.2 54.29,40.32 54.29,44.13 IC4.12 | v43.18,58.42 42.23,59.37 CF-CARD.1 | v59.69,58.74 C4.2 | v40.16,17.78 40.64,17.3 IC2.7
  Bottom 0.356: MOUSE.4 13.02,14.13 14.29,12.86 21.59,12.86 C2.2 v40.16,17.78 | R12.1 19.68,31.11 23.5,31.11 25.48,29.13 | 25.48,29.13 W5100S-MODULE.26 W5100S-MODULE.27 29.37,27.94 30.64,29.21 35.56,29.21 W5100S-MODULE.30 | W5100S-MODULE.25 25.24,29.05 25.4,29.05 25.48,29.13 | IC2.7 40.8,12.54 45.88,12.54 IC3.10 47.15,11.43 47.62,11.91 53.5,11.91 54.13,12.54 55.24,12.54 56.36,11.43 IC5.12 IC5.13 | C4.2 59.69,79.22 58.9,79.22 57.31,80.8 57.31,83.66 64.93,83.66 RESET.2 | 68.34,43.42 68.58,43.18 C5.2 | 68.34,43.42 C1.2 | IC1.5 59.69,58.42 | 59.69,58.42 v43.18,58.42 | IC4.12 55.72,43.34 68.26,43.34 68.34,43.42 | v59.69,58.74 59.69,58.42
  other vias: 14.61,81.92 17.14,81.92 19.68,81.92 19.68,80.01 17.14,80.01 14.61,80.01 38.1,81.92 41.28,81.92 44.45,81.92 44.45,80.01 41.28,80.01 38.1,80.01 48.26,61.59 46.36,57.78 58.42,53.97 72.39,56.51 71.75,20.96 29.21,15.88 5.08,17.14 5.71,44.45 40.64,22.86 33.02,24.13 21.59,34.92 20.32,29.84 19.05,25.4 20.96,26.04 49.53,8.26 26.67,10.79 30.48,3.81 45.72,3.81 63.5,12.7 46.36,36.83 19.05,16.51 33.02,17.78 39.37,8.89 36.83,64.77 16.51,64.77 48.89,53.97 48.89,50.8 48.89,45.08 71.75,31.75 73.02,37.46 69.85,50.8 52.07,16.51 61.59,17.78 35.56,15.24 11.43,48.89 12.7,41.27 43.18,26.04 36.83,38.1 24.13,40 35.56,10.79 36.83,46.99 25.4,64.14 19.68,63.5 19.05,12.07 23.5,12.07 41.91,8.89 24.77,10.16 55.88,20.32 33.02,34.92 55.88,24.77 33.66,47.62 19.05,40 27.94,43.18 52.7,32.38 52.7,34.92 36.83,41.91 55.88,26.67 43.81,22.86
  pour Top: 0,86.36 78.74,86.36 78.74,0 0,0
  pour Bottom: 0,86.36 0,0 78.74,0 78.74,86.36
MOUSED0
  Top 0.254: IC3.17 56.04,28.1 56.04,53.82 60.64,58.42 60.64,62.07 62.23,63.66 66.2,63.66 66.2,67.47 IC1.1
MOUSED1  (via drill 0.35)
  Top 0.254: v64.29,22.86 64.61,23.18 64.61,47.31 64.77,47.47 64.77,51.59 v64.45,51.91
  Bottom 0.254: IC3.15 55.88,22.86 v64.29,22.86 | v64.45,51.91 65.88,53.34 IC1.7
MOUSED2  (via drill 0.35)
  Top 0.254: v63.34,15.24 63.5,15.4 v63.5,50.16
  Bottom 0.254: IC3.13 55.72,15.4 59.05,15.4 59.21,15.24 v63.34,15.24 | v63.5,50.16 63.82,50.48 66.99,50.48 IC1.8
MOUSED3  (via drill 0.35)
  Top 0.254: IC3.11 57.15,13.97 57.15,44.29 57.63,44.77 57.63,46.83 v57.31,47.15
  Bottom 0.254: v57.31,47.15 58.42,48.26 IC1.9
MOUSED4  (via drill 0.35)
  Top 0.254: v50.64,19.37 51.59,20.32 51.59,36.2 53.5,38.1 53.5,38.42 v55.24,40.16 | v72.39,41.75 73.82,43.18 73.82,45.4 74.93,46.51 IC1.10
  Bottom 0.254: IC3.8 49.85,19.37 v50.64,19.37 | v55.24,40.16 56.83,41.75 v72.39,41.75
MOUSED5  (via drill 0.35)
  Top 0.254: v53.18,21.59 54.61,23.02 56.67,23.02 56.67,45.08 v56.83,45.24
  Bottom 0.254: v53.18,21.59 IC3.6 | v56.83,45.24 57.47,45.88 70.01,45.88 IC1.11
MOUSED6  (via drill 0.35)
  Top 0.254: v58.42,30.16 58.9,30.16 59.21,30.48 60.96,30.48 60.96,39.85 60.33,40.48 v60.33,50.32
  Bottom 0.254: IC3.4 48.42,28.1 56.36,28.1 v58.42,30.16 | v60.33,50.32 60.96,50.96 66.04,50.96 67.31,52.23 73.82,52.23 IC1.12
MOUSED7  (via drill 0.35)
  Top 0.254: IC3.2 48.1,32.86 v48.1,36.35 | v70.96,38.1 71.28,38.42 71.28,43.66 73.82,46.2 73.82,54.77 IC1.13
  Bottom 0.254: v48.1,36.35 48.74,36.99 58.1,36.99 59.21,38.1 v70.96,38.1
N$1
  Bottom 0.254: CF-ACT.A 62.39,77.31 66.2,77.31 R3.2
N$41
  Top 0.254: IC2.9 IC2.6
PHI
  Top 0.254: CON1.50 69.85,12.7 75.41,12.7 76.2,13.49 76.2,15.24 74.45,15.24 70.17,19.53 70.17,43.34 70.96,44.13 70.96,59.53 IC1.16
RTCAS
  Top 0.254: IC5.14 68.74,20.16 68.74,62.07 66.99,62.07 66.2,61.28 66.2,61.12 IC4.18
RTCDS  (via drill 0.35)
  Top 0.254: v61.75,34.77 61.75,39.85 61.12,40.48 61.12,61.12 IC4.20
  Bottom 0.254: IC5.17 v61.75,34.77
RTCR
  Bottom 0.254: IC5.15 76.68,16.51 76.68,55.56 75.25,56.99 74.93,56.99 72.39,59.53 62.39,59.53 IC4.19
USBD+  (via drill 0.35)
  Top 0.254: v6.03,50.8 8.41,48.42 8.41,32.54 12.86,28.1 12.86,22.86 13.97,21.75 13.97,17.78 13.02,16.83 MOUSE.3
  Bottom 0.254: R1.1 13.81,16.67 13.02,16.67 MOUSE.3 | IC1.17 76.36,67.47 76.36,73.5 21.11,73.5 2.7,55.09 2.7,50.8 v6.03,50.8
USBD-  (via drill 0.35)
  Top 0.254: v19.84,70.96 2.7,53.82 2.7,40.48 5.24,37.94 v5.24,26.35
  Bottom 0.254: R2.1 14.29,18.73 13.02,18.73 MOUSE.2 12.86,18.89 12.7,18.89 v5.24,26.35 | IC1.18 72.55,70.96 v19.84,70.96
VCC  (via drill 0.35)
  Top 0.356: C4.1 IC4.24 | C3.1 IC3.20 | IC5.24 C5.1 74.93,43.34 76.04,44.45 76.04,57.31 75.96,57.39 76.04,57.47 76.04,58.42 | R3.1 76.04,75.09 76.04,58.42 | R13.1 13.97,34.29 W5100S-MODULE.21 | CF-CARD.13 26.99,59.53 26.35,59.53 CF-CARD.38 26.35,54.77 25.4,53.82 25.4,52.07 25.72,51.75 25.72,45.08 25.56,44.93 25.56,42.39 28.1,39.85 28.1,36.2 31.43,32.86 31.43,28.42 31.75,28.1 W5100S-MODULE.28 v31.75,21.75 | CON1.27 43.18,3.81 43.18,12.22 43.5,12.54 v43.5,20.16 | 76.04,58.42 IC1.14
  Bottom 0.356: R3.1 73.82,75.09 63.34,75.09 C4.1 | C1.1 70.01,44.29 73.82,44.29 C5.1 | 15.24,21.59 R1.2 R2.2 20.32,21.59 C2.1 IC2.14 25.56,20.32 26.67,21.43 31.75,21.43 | 15.24,21.59 13.18,21.59 13.02,21.43 MOUSE.1 | v43.5,20.16 42.23,21.43 31.75,21.43 | v31.75,21.75 31.75,21.43 | 15.24,21.59 15.24,27.94 | R13.1 13.18,38.58 22.07,38.58 22.54,39.05 50.32,39.05 50.48,39.21 53.34,39.21 54.45,38.1 C3.1 57.15,40.64 73.66,40.64 IC5.24 | 15.24,27.94 W5100S-MODULE.22 | W5100S-MODULE.21 15.24,27.94
W51D0  (via drill 0.35)
  Top 0.254: R4.2 34.92,45.08 v34.92,51.43
  Bottom 0.254: W5100S-MODULE.3 v34.92,51.43
W51D1
  Top 0.254: R5.2 32.54,45.24 32.54,51.59 W5100S-MODULE.4
W51D2  (via drill 0.35)
  Top 0.254: R6.2 30,45.24 v30,51.59
  Bottom 0.254: W5100S-MODULE.5 v30,51.59
W51D3  (via drill 0.35)
  Top 0.254: R7.2 27.46,45.24 v27.46,51.59
  Bottom 0.254: W5100S-MODULE.6 v27.46,51.59
W51D4  (via drill 0.35)
  Top 0.254: R8.2 24.77,45.08 v24.77,51.43
  Bottom 0.254: W5100S-MODULE.7 v24.77,51.43
W51D5  (via drill 0.35)
  Top 0.254: v21.59,50.8 R9.2
  Bottom 0.254: W5100S-MODULE.8 v21.59,50.8
W51D6  (via drill 0.35)
  Top 0.254: R10.2 19.37,44.77 v19.37,51.12
  Bottom 0.254: W5100S-MODULE.9 v19.37,51.12
W51D7  (via drill 0.35)
  Top 0.254: R11.2 17.14,45.08 v17.14,51.43
  Bottom 0.254: W5100S-MODULE.10 v17.14,51.43

### Text on the board
bNames: CYBOARD v1.2 for / AMSTRAD CPC / d_kef 2022